# EAGLE design mayav2 esp32 (EAGLE 9.4.2)
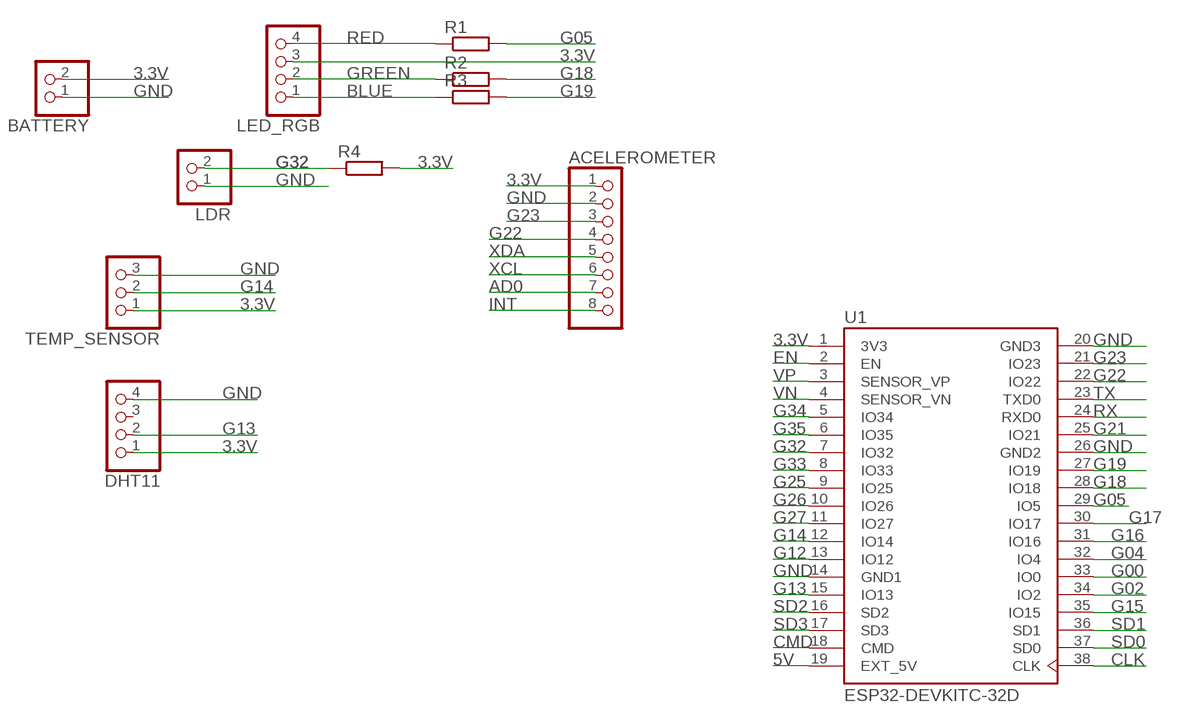
[diagram p0: schematic, sheet 1]

## Parts
ACELEROMETER  PINHD-1X8  [1X08]
BATTERY  PINHD-1X2  [1X02]
DHT11  PINHD-1X4  [1X04]
LDR  PINHD-1X2  [1X02]
LED_RGB  PINHD-1X4  [1X04]
R1  R-EU_0204/7  [0204/7]
R2  R-EU_0204/7  [0204/7]
R3  R-EU_0204/7  [0204/7]
R4  R-EU_0204/7  [0204/7]
TEMP_SENSOR  PINHD-1X3  [1X03]
U1  ESP32-DEVKITC-32D  [MODULE_ESP32-DEVKITC-32D]

## Nets
3.3V: ACELEROMETER.1 BATTERY.2 DHT11.1 LED_RGB.3 R4.2 TEMP_SENSOR.1 U1.1(3V3)
5V: U1.19(EXT_5V)
AD0: ACELEROMETER.7
BLUE: LED_RGB.1 R3.1
CLK: U1.38(CLK)
CMD: U1.18(CMD)
EN: U1.2(EN)
G00: U1.33(IO0)
G02: U1.34(IO2)
G04: U1.32(IO4)
G05: R1.2 U1.29(IO5)
G12: U1.13(IO12)
G13: DHT11.2 U1.15(IO13)
G14: TEMP_SENSOR.2 U1.12(IO14)
G15: U1.35(IO15)
G16: U1.31(IO16)
G17: U1.30(IO17)
G18: R2.2 U1.28(IO18)
G19: R3.2 U1.27(IO19)
G21: U1.25(IO21)
G22: ACELEROMETER.4 U1.22(IO22)
G23: ACELEROMETER.3 U1.21(IO23)
G25: U1.9(IO25)
G26: U1.10(IO26)
G27: U1.11(IO27)
G32: LDR.2 R4.1 U1.7(IO32)
G33: U1.8(IO33)
G34: U1.5(IO34)
G35: U1.6(IO35)
GND: ACELEROMETER.2 BATTERY.1 DHT11.4 LDR.1 TEMP_SENSOR.3 U1.14(GND1) U1.20(GND3) U1.26(GND2)
GREEN: LED_RGB.2 R2.1
INT: ACELEROMETER.8
RED: LED_RGB.4 R1.1
RX: U1.24(RXD0)
SD0: U1.37(SD0)
SD1: U1.36(SD1)
SD2: U1.16(SD2)
SD3: U1.17(SD3)
TX: U1.23(TXD0)
VN: U1.4(SENSOR_VN)
VP: U1.3(SENSOR_VP)
XCL: ACELEROMETER.6
XDA: ACELEROMETER.5
Unconnected: DHT11.3

## Library data of the parts
ACELEROMETER = pinhead:PINHD-1X8: PIN HEADER
BATTERY LDR = pinhead:PINHD-1X2: PIN HEADER
DHT11 LED_RGB = pinhead:PINHD-1X4: PIN HEADER
R1-R4 = rcl:R-EU_: RESISTOR, European symbol; SPICEPREFIX: R
TEMP_SENSOR = pinhead:PINHD-1X3: PIN HEADER
U1 = ESP32-DEVKITC-32D:ESP32-DEVKITC-32D: Eval Board For Esp-Wroom-32; AVAILABILITY: Unavailable; DESCRIPTION: EVAL BOARD FOR ESP-WROOM-32; MF: Espressif Systems; MP: ESP32-DEVKITC-32D; PACKAGE: None; PRICE: None

## Board
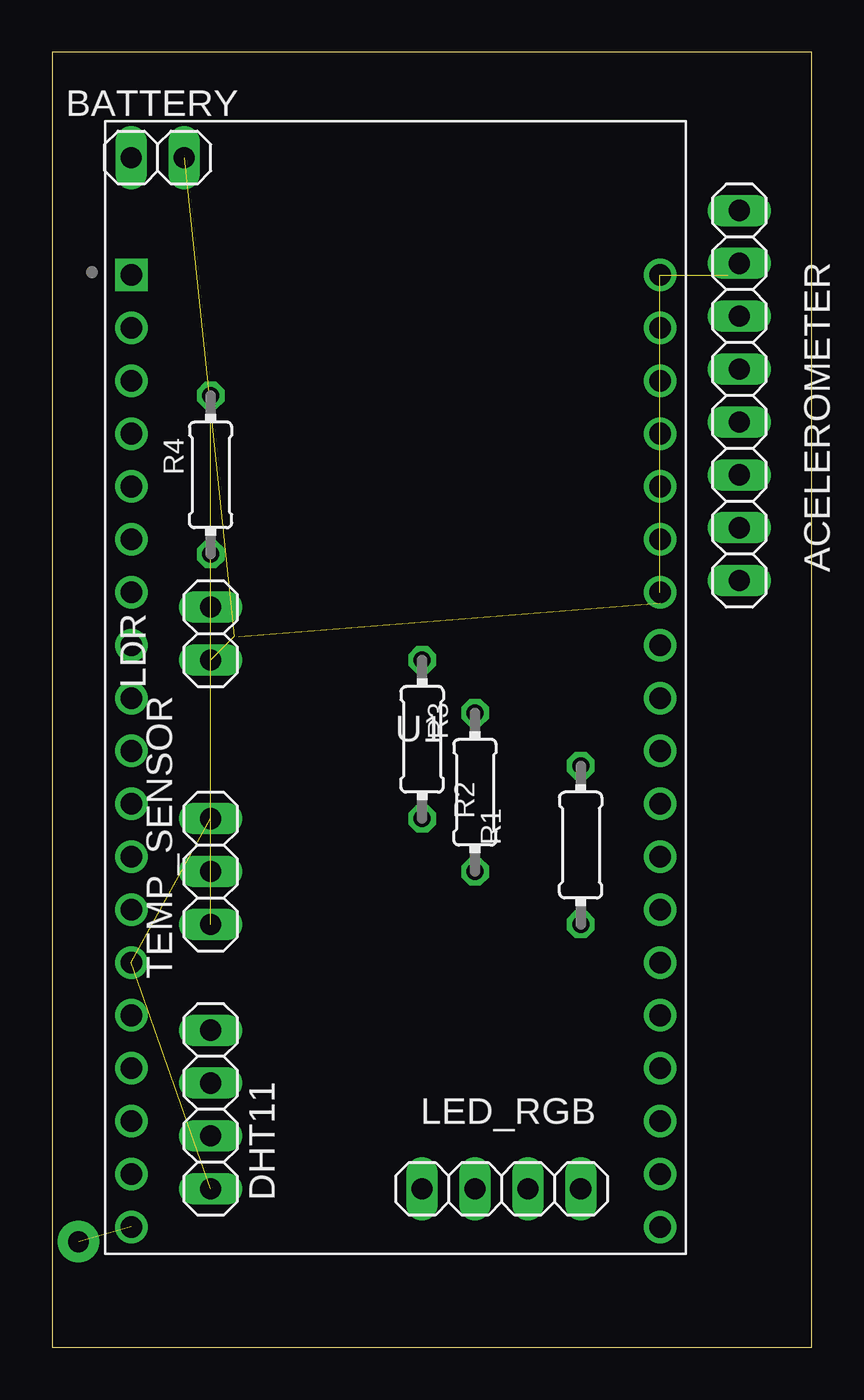
[diagram p1: board, top side]
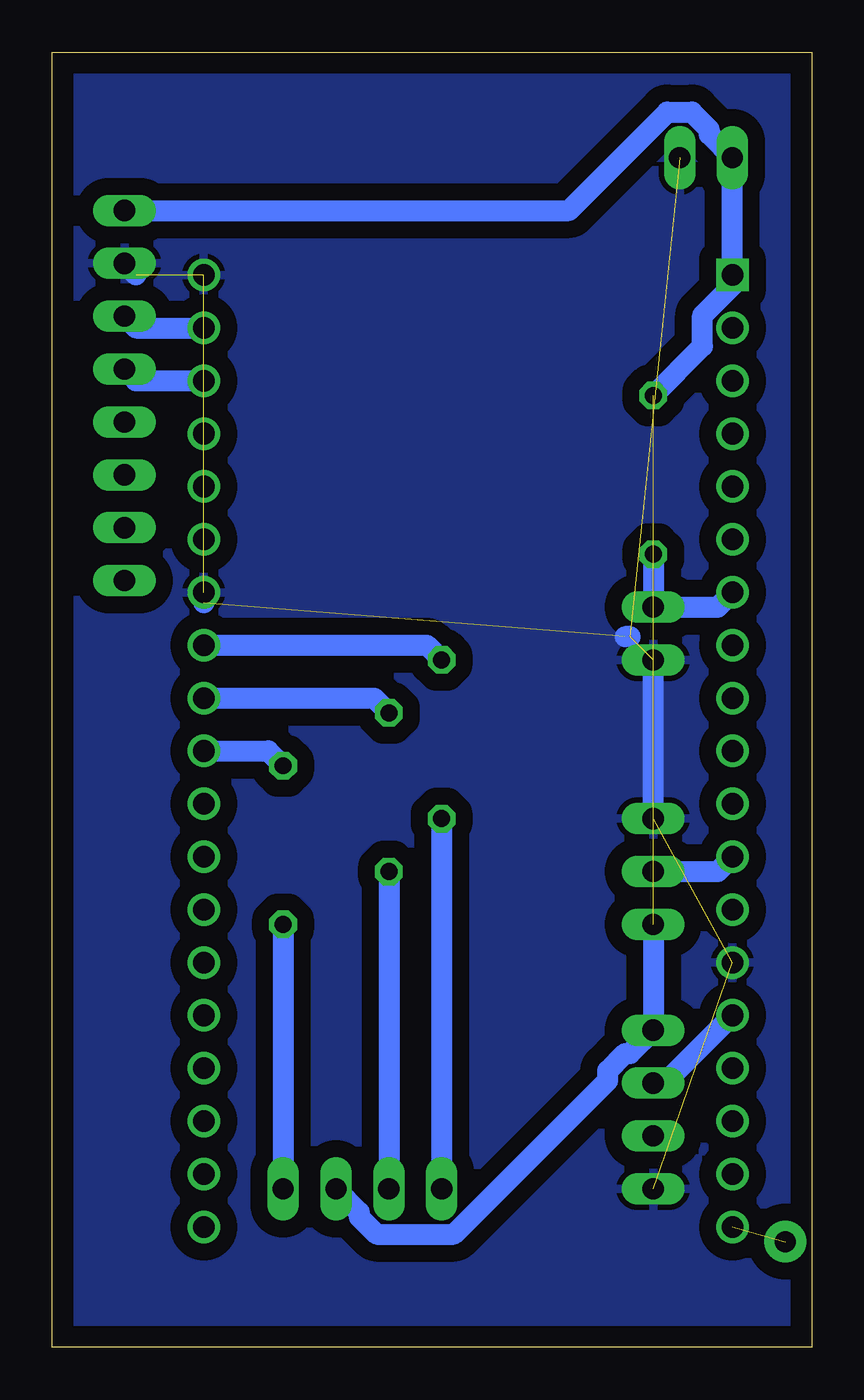
[diagram p2: board, bottom side, seen from below]

Size 36.5 x 62.22 mm. Coordinates in mm from the lower left corner, seen from the top.
Outline: 0,0 36.5,0 36.5,62.22 0,62.22 0,0
Copper layers (1*16): Top 0.035mm / dielectric 1.5mm / Bottom 0.035mm
Design rules "default": minimum track width 6mil, minimum drill 0.35mm, track to track 6mil, track to pad 6mil, pad to pad 6mil, via to via 6mil, smd to smd 6mil, copper to edge 40mil, drill to drill 6mil, minimum pad ring 10mil, minimum via ring 8mil, stop-mask expansion 4mil, vias tented up to drill 0mil, thermal gap 10mil

### Footprints (pad centres in the part's own frame; a part is rotated, then mirrored left to right if it is on the bottom)
1X08 = drill 1.016 long: 1 -8.89,0; 2 -6.35,0; 3 -3.81,0; 4 -1.27,0; 5 1.27,0; 6 3.81,0; 7 6.35,0; 8 8.89,0
1X02 = drill 1.016 long: 1 -1.27,0; 2 1.27,0
1X04 = drill 1.016 long: 1 -3.81,0; 2 -1.27,0; 3 1.27,0; 4 3.81,0
0204/7 = drill 0.813 octagon: 1 -3.81,0; 2 3.81,0
1X03 = drill 1.016 long: 1 -2.54,0; 2 0,0; 3 2.54,0
MODULE_ESP32-DEVKITC-32D = drill 1.04 square: 1 -12.7,19.76 | drill 1.04: 2 -12.7,17.22; 3 -12.7,14.68; 4 -12.7,12.14; 5 -12.7,9.6; 6 -12.7,7.06; 7 -12.7,4.52; 8 -12.7,1.98; 9 -12.7,-0.56; 10 -12.7,-3.1; 11 -12.7,-5.64; 12 -12.7,-8.18; 13 -12.7,-10.72; 14 -12.7,-13.26; 15 -12.7,-15.8; 16 -12.7,-18.34; 17 -12.7,-20.88; 18 -12.7,-23.42; 19 -12.7,-25.96; 20 12.7,19.76; 21 12.7,17.22; 22 12.7,14.68; 23 12.7,12.14; 24 12.7,9.6; 25 12.7,7.06; 26 12.7,4.52; 27 12.7,1.98; 28 12.7,-0.56; 29 12.7,-3.1; 30 12.7,-5.64; 31 12.7,-8.18; 32 12.7,-10.72; 33 12.7,-13.26; 34 12.7,-15.8; 35 12.7,-18.34; 36 12.7,-20.88; 37 12.7,-23.42; 38 12.7,-25.96

### Placement (x,y rotation side)
ACELEROMETER  33.02,45.72 270 top
BATTERY  5.08,57.15 180 top
DHT11  7.62,11.43 270 top
LDR  7.62,34.29 90 top
LED_RGB  21.59,7.62 0 top
R1  25.4,24.13 90 top
R2  20.32,26.67 90 top
R3  17.78,29.21 90 top
R4  7.62,41.91 90 top
TEMP_SENSOR  7.62,22.86 90 top
U1  16.51,31.75 0 top

### Tracks (layer width: path | path; a pad name or v marks a point on that pad's centre or on a via)
3.3V  (1 unrouted)
  Bottom 1.016: R4.2 5.25,48.09 5.25,49.57 3.81,51.01 U1.1 BATTERY.2 4.93,58.27 4.93,58.5 5.76,59.33 6.94,59.33 11.66,54.61 ACELEROMETER.1 | TEMP_SENSOR.1 DHT11.1 8.74,14.12 8.97,14.12 9.8,13.29 9.8,12.82 17.19,5.44 20.91,5.44 21.74,6.27 21.74,6.5 LED_RGB.3
5V  (via drill 1 pad 2)  (1 unrouted)
  other vias: 1.27,5.08
BLUE
  Bottom 1.016: R3.1 LED_RGB.1
G05
  Bottom 1.016: U1.29 26.11,28.65 R1.2
G13
  Bottom 1.016: DHT11.2 7.06,12.7 U1.15
G14
  Bottom 1.016: TEMP_SENSOR.2 4.52,22.86 U1.12
G18
  Bottom 1.016: U1.28 21.03,31.19 R2.2
G19
  Bottom 1.016: U1.27 18.49,33.73 R3.2
G22
  Bottom 1.016: ACELEROMETER.4 32.46,46.43 U1.22
G23
  Bottom 1.016: ACELEROMETER.3 32.46,48.97 U1.21
G32
  Bottom 1.016: U1.7 4.52,35.56 LDR.2 R4.1
GND  (7 unrouted)
  Bottom 1.016: ACELEROMETER.2 32.46,51.51 | TEMP_SENSOR.3 LDR.1 | 8.74,34.14 8.97,34.14 | 29.21,35.77 U1.26
  pour Bottom (isolate 0.813): 0,0 36.83,0 36.83,62.23 0,62.23
GREEN
  Bottom 1.016: R2.1 LED_RGB.2
RED
  Bottom 1.016: R1.1 LED_RGB.4